# EAGLE design sound-barnacle (EAGLE 6.6.0)
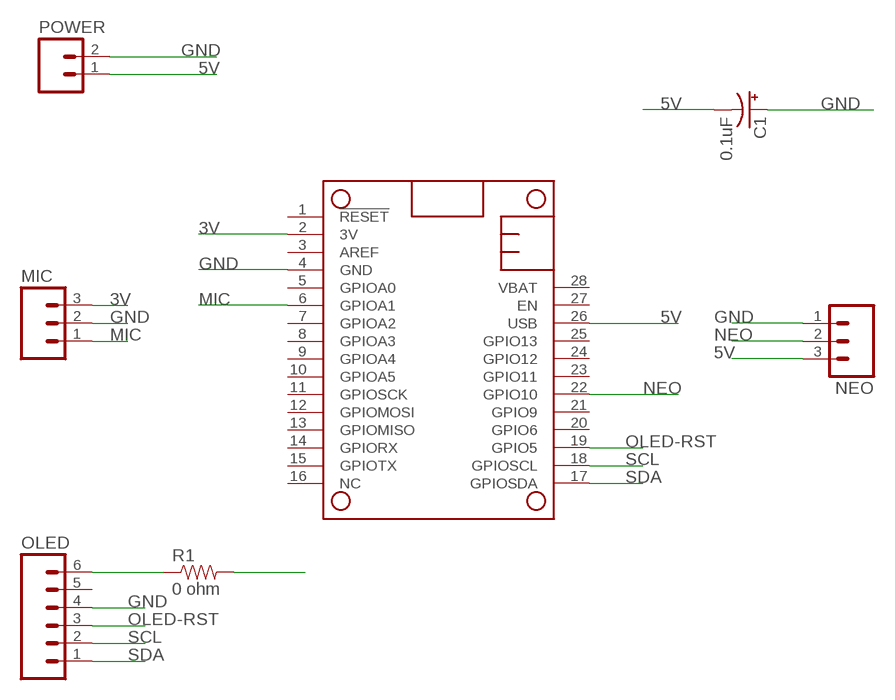
[diagram p0: schematic, sheet 1]

## Parts
C1  0.1uF  CPOL-USB45181B  [B45181B]
MIC  M03LOCK_LONGPADS  [1X03_LOCK_LONGPADS]
MS1  FEATHERWING  [FEATHERWING]
NEO  M03LOCK_LONGPADS  [1X03_LOCK_LONGPADS]
OLED  M06LOCK_LONGPADS  [1X06_LOCK_LONGPADS]
POWER  M02LOCK_LONGPADS  [1X02_LOCK_LONGPADS]
R1  0 ohm  RESISTORAXIAL-0.3  [AXIAL-0.3]

## Nets
3V: MIC.3 MS1.2(3V) R1.P$2
5V: C1.- MS1.26(USB) NEO.3 POWER.1
GND: C1.+ MIC.2 MS1.4(GND) NEO.1 OLED.4 POWER.2
MIC: MIC.1 MS1.6(GPIOA1)
N$1: OLED.6 R1.P$1
NEO: MS1.22(GPIO10) NEO.2
OLED-RST: MS1.19(GPIO5) OLED.3
SCL: MS1.18(GPIOSCL) OLED.2
SDA: MS1.17(GPIOSDA) OLED.1
Unconnected: MS1.1(!RESET) MS1.3(AREF) MS1.5(GPIOA0) MS1.7(GPIOA2) MS1.8(GPIOA3) MS1.9(GPIOA4) MS1.10(GPIOA5) MS1.11(GPIOSCK) MS1.12(GPIOMOSI) MS1.13(GPIOMISO) MS1.14(GPIORX) MS1.15(GPIOTX) MS1.16(NC) MS1.20(GPIO6) MS1.21(GPIO9) MS1.23(GPIO11) MS1.24(GPIO12) MS1.25(GPIO13) MS1.27(EN) MS1.28(VBAT) OLED.5

## Library data of the parts
C1 = adafruit:CPOL-US: POLARIZED CAPACITOR, American symbol
MIC NEO = SparkFun-Connectors:M03: Header 3 Standard 3-pin 0.1" header. Use with straight break away headers (SKU : PRT-00116), right angle break away headers (PRT-00553), swiss pins (PRT-00743), machine pins (PRT-00117), and female headers (PRT-00115). Molex polarized connector foot print use with SKU : PRT-08232 with associated crimp pins and housings.
MS1 = adafruit:FEATHERWING
OLED = SparkFun-Connectors:M06: Header 6 Standard 6-pin 0.1" header. Use with straight break away headers (SKU : PRT-00116), right angle break away headers (PRT-00553), swiss pins (PRT-00743), machine pins (PRT-00117), and female headers (PRT-00115). Molex polarized connector foot print use with SKU : PRT-08094 with associated crimp pins and housings. NOTES ON THE VARIANTS LOCK and LOCK_LONGPADS... This footprint was designed to help hold the alignment of a through-hole component (i.e. 6-pin header) while soldering it into place. You may notice that each hole has been shifted either up or down by 0.005 of an inch from it's more standard position (which is a perfectly straight line). This slight alteration caused the pins (the squares in the middle) to touch the edges of the holes. Because they are alternating, it causes a "brace" to hold the component in place. 0.005 has proven to be the perfect amount of "off-center" position when using our standard breakaway headers. Although looks a little odd when you look at the bare footprint, once you have a header in there, the alteration is very hard to notice. Also,if you push a header all the way into place, it is covered up entirely on the bottom side. This idea of altering the position of holes to aid alignment will be further integrated into the Sparkfun Library for other footprints. It can help hold any component with 3 or more connection pins.
POWER = SparkFun-Connectors:M02: Standard 2-pin 0.1" header. Use with - straight break away headers ( PRT-00116) - right angle break away headers (PRT-00553) - swiss pins (PRT-00743) - machine pins (PRT-00117) - female headers (PRT-00115) Molex polarized connector foot print use with: PRT-08233 with associated crimp pins and housings. 2.54_SCREWTERM for use with PRT-10571. 3.5mm Screw Terminal footprints for PRT-08084 5mm Screw Terminal footprints for use with PRT-08432
R1 = SparkFun-Resistors:RESISTOR: Resistor Basic schematic elements and footprints for 0603, 1206, and PTH resistors.

## Board
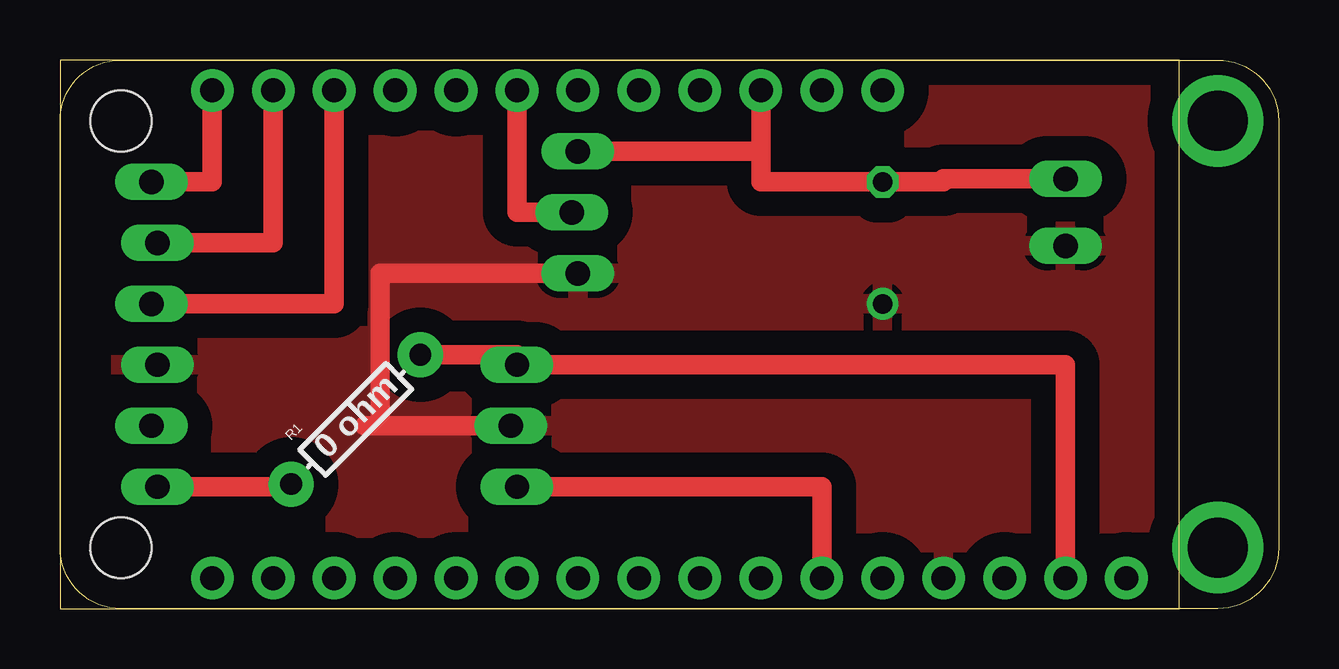
[diagram p1: board, top side]
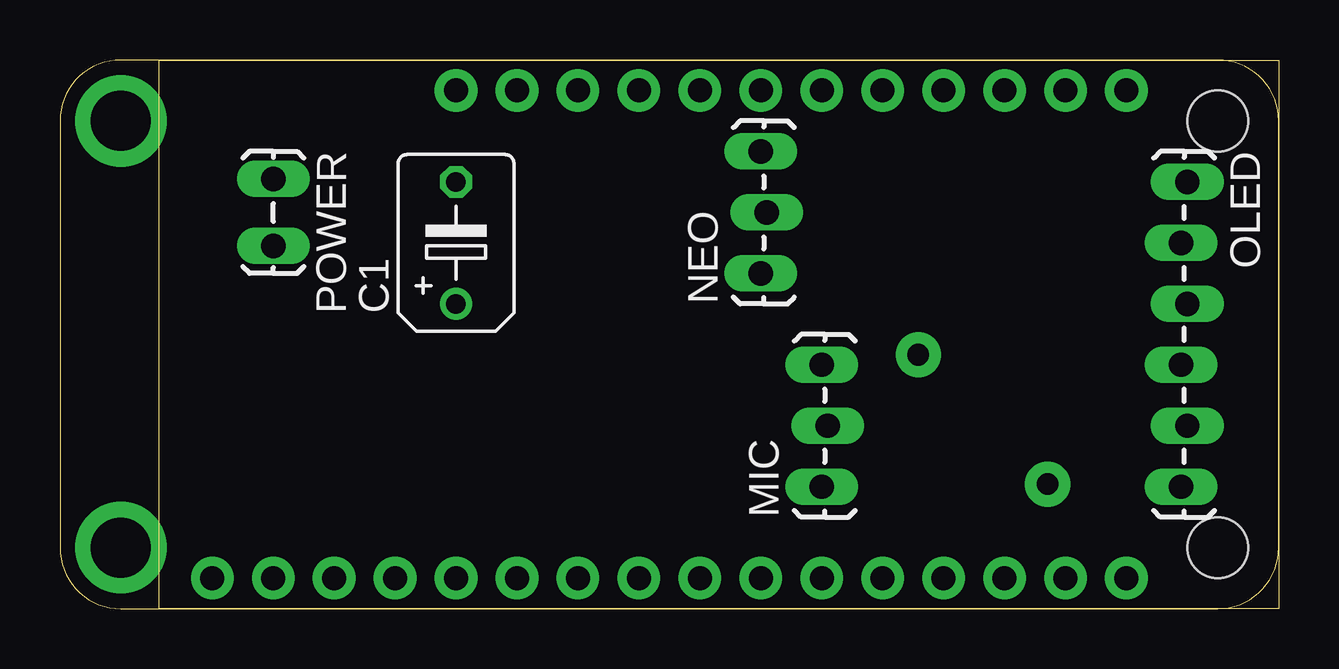
[diagram p2: board, bottom side, seen from below]

Size 46.66 x 22.85 mm. Coordinates in mm from the lower left corner, seen from the top.
Outline: 0,0 46.66,0 46.66,22.85 0,22.85 0,0
Copper layers (1*16): Top 0.035mm / dielectric 1.5mm / Bottom 0.035mm
Design rules "default": minimum track width 10mil, minimum drill 24mil, track to track 8mil, track to pad 8mil, pad to pad 8mil, via to via 8mil, smd to smd 8mil, copper to edge 40mil, drill to drill 8mil, minimum pad ring 10mil, minimum via ring 8mil, stop-mask expansion 4mil, vias tented up to drill 0mil, thermal gap 10mil

### Footprints (pad centres in the part's own frame; a part is rotated, then mirrored left to right if it is on the bottom)
B45181B = drill 0.813: + -2.54,0 | drill 0.813 octagon: - 2.54,0
1X03_LOCK_LONGPADS = drill 1.016 long: 1 0,0; 2 2.54,-0.254; 3 5.08,0
FEATHERWING = drill 1 pad 1.778: 1 6.35,1.27; 2 8.89,1.27; 3 11.43,1.27; 4 13.97,1.27; 5 16.51,1.27; 6 19.05,1.27; 7 21.59,1.27; 8 24.13,1.27; 9 26.67,1.27; 10 29.21,1.27; 11 31.75,1.27; 12 34.29,1.27; 13 36.83,1.27; 14 39.37,1.27; 15 41.91,1.27; 16 44.45,1.27; 17 44.45,21.59; 18 41.91,21.59; 19 39.37,21.59; 20 36.83,21.59; 21 34.29,21.59; 22 31.75,21.59; 23 29.21,21.59; 24 26.67,21.59; 25 24.13,21.59; 26 21.59,21.59; 27 19.05,21.59; 28 16.51,21.59 | drill 2.5 pad 3.81: P$1 2.54,20.32; P$2 2.54,2.54 | hole 2.54: 48.26,20.32; 48.26,2.54
1X06_LOCK_LONGPADS = drill 1.016 long: 1 0,0; 2 2.54,-0.254; 3 5.08,0; 4 7.62,-0.254; 5 10.16,0; 6 12.7,-0.254
1X02_LOCK_LONGPADS = drill 1.016 long: 1 -0.127,0; 2 2.667,0
AXIAL-0.3 = drill 0.9 pad 1.88: P$1 -3.81,0; P$2 3.81,0

### Placement (x,y rotation side)
C1  34.29,15.24 90 bottom
MIC  19.05,5.08 90 bottom
MS1  50.8,0 0 bottom
NEO  21.59,13.97 90 bottom
OLED  3.81,17.78 270 bottom
POWER  41.91,17.78 270 bottom
R1  12.33,7.88 45 top

### Tracks (layer width: path | path; a pad name or v marks a point on that pad's centre or on a via)
3V
  Top 0.813: MS1.2 41.91,10.16 MIC.3 19.05,10.58 R1.P$2
5V
  Top 0.813: POWER.1 36.83,17.91 36.83,17.78 C1.- 29.21,17.78 29.21,19.05 | 29.21,19.05 MS1.26 | NEO.3 29.21,19.05
GND
  Top 0.813: MIC.2 13.34,7.62 | 12.7,7.62 13.34,7.62 | 13.34,7.62 13.34,13.97 NEO.1
  pour Top (isolate 1.016): 2.54,22.86 2.54,0 45.72,0 45.72,22.86
MIC
  Top 0.813: MIC.1 31.75,5.08 MS1.6
N$1
  Top 0.813: OLED.6 9.63,5.08 R1.P$1
NEO
  Top 0.813: NEO.2 19.05,16.51 MS1.22
OLED-RST
  Top 0.813: MS1.19 11.43,12.7 OLED.3
SCL
  Top 0.813: MS1.18 8.89,15.24 OLED.2
SDA
  Top 0.813: MS1.17 6.35,17.78 OLED.1